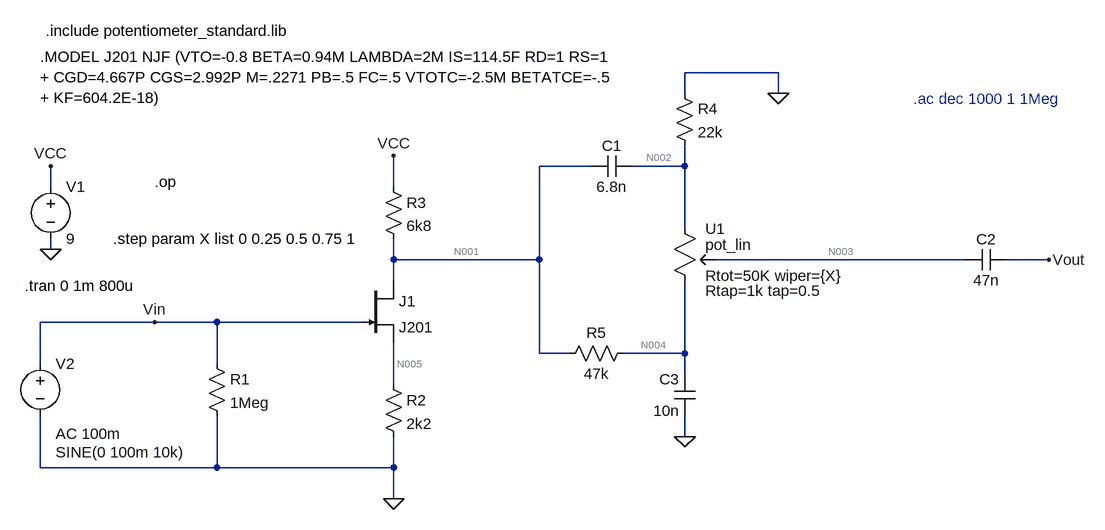
[diagram p0: schematic PrimerEtapa.asc]
PrimerEtapa.asc, the LTspice schematic file:
Version 4
SHEET 1 1232 776
WIRE 736 80 592 80
WIRE 592 112 592 80
WIRE 736 112 736 80
WIRE 448 224 368 224
WIRE 592 224 592 192
WIRE 592 224 512 224
WIRE -384 256 -384 224
WIRE 144 256 144 208
WIRE 592 320 592 224
WIRE -384 352 -384 336
WIRE 144 368 144 336
WIRE 368 368 368 224
WIRE 368 368 144 368
WIRE 1024 368 640 368
WIRE 1152 368 1088 368
WIRE 144 400 144 368
WIRE -224 464 -400 464
WIRE -128 464 -224 464
WIRE 96 464 -128 464
WIRE 368 512 368 368
WIRE 416 512 368 512
WIRE 592 512 592 400
WIRE 592 512 496 512
WIRE -400 528 -400 464
WIRE -128 528 -128 464
WIRE 592 544 592 512
WIRE 144 560 144 496
WIRE 592 640 592 608
WIRE -400 688 -400 608
WIRE -128 688 -128 608
WIRE -128 688 -400 688
WIRE 144 688 144 640
WIRE 144 688 -128 688
WIRE 144 736 144 688
FLAG 144 736 0
FLAG -384 352 0
FLAG -384 224 VCC
FLAG 144 208 VCC
FLAG -224 464 Vin
FLAG 592 640 0
FLAG 1152 368 Vout
FLAG 736 112 0
SYMBOL njf 96 400 R0
SYMATTR InstName J1
SYMATTR Value J201
SYMBOL res -144 512 R0
SYMATTR InstName R1
SYMATTR Value 1Meg
SYMBOL res 128 544 R0
SYMATTR InstName R2
SYMATTR Value 2k2
SYMBOL res 128 240 R0
SYMATTR InstName R3
SYMATTR Value 6k8
SYMBOL voltage -384 240 R0
SYMATTR InstName V1
SYMATTR Value 9
SYMBOL voltage -400 512 R0
WINDOW 3 24 152 Left 2
WINDOW 123 24 124 Left 2
WINDOW 39 0 0 Left 2
SYMATTR Value SINE(0 100m 10k)
SYMATTR Value2 AC 100m
SYMATTR InstName V2
SYMBOL cap 512 208 R90
WINDOW 0 0 32 VBottom 2
WINDOW 3 32 32 VTop 2
SYMATTR InstName C1
SYMATTR Value 6.8n
SYMBOL cap 1088 352 R90
WINDOW 0 0 32 VBottom 2
WINDOW 3 32 32 VTop 2
SYMATTR InstName C2
SYMATTR Value 47n
SYMBOL cap 608 608 R180
WINDOW 0 24 56 Left 2
WINDOW 3 24 8 Left 2
SYMATTR InstName C3
SYMATTR Value 10n
SYMBOL res 576 96 R0
SYMATTR InstName R4
SYMATTR Value 22k
SYMBOL res 512 496 R90
WINDOW 0 0 56 VBottom 2
WINDOW 3 32 56 VTop 2
SYMATTR InstName R5
SYMATTR Value 47k
SYMBOL potentiometer_standard 576 304 R0
SYMATTR InstName U1
SYMATTR Value Rtot=50K wiper={X}
TEXT -400 56 Left 2 !.MODEL J201 NJF (VTO=-0.8 BETA=0.94M LAMBDA=2M IS=114.5F RD=1 RS=1\n+ CGD=4.667P CGS=2.992P M=.2271 PB=.5 FC=.5 VTOTC=-2.5M BETATCE=-.5\n+ KF=604.2E-18)
TEXT -424 408 Left 2 !.tran 0 1m 800u
TEXT -224 248 Left 2 !.op
TEXT -392 16 Left 2 !.include potentiometer_standard.lib
TEXT -288 336 Left 2 !.step param X list 0 0.25 0.5 0.75 1
TEXT 944 120 Left 2 ;.ac dec 1000 1 1Meg

The netlist it stands for:
* PrimerEtapa.asc
J1 N001 Vin N005 J201
R1 Vin 0 1Meg
R2 N005 0 2k2
R3 VCC N001 6k8
V1 VCC 0 9
V2 Vin 0 SINE(0 100m 10k) AC 100m
C1 N002 N001 6.8n
C2 Vout N003 47n
C3 0 N004 10n
R4 0 N002 22k
R5 N004 N001 47k
XU1 N002 N004 N003 pot_lin Rtot=50K wiper={X} Rtap=1k tap=0.5  ; pins A B C
.model NJF NJF
.model PJF PJF
.lib standard.jft
.MODEL J201 NJF (VTO=-0.8 BETA=0.94M LAMBDA=2M IS=114.5F RD=1 RS=1
+ CGD=4.667P CGS=2.992P M=.2271 PB=.5 FC=.5 VTOTC=-2.5M BETATCE=-.5
+ KF=604.2E-18)
.tran 0 1m 800u
.op
.include potentiometer_standard.lib
.step param X list 0 0.25 0.5 0.75 1
* .ac dec 1000 1 1Meg
.backanno
.end

* Results of the author's LTspice run, read from the files saved beside the schematic
* Operating Point (first step), zero values left out:
*   V(n001) = 7.413 V
*   V(n005) = 376.3 mV
*   V(vcc) = 9 V
*   V(n002) = 1.371 V
*   V(vout) = 210.8 nV
*   V(n003) = 4.485 V
*   V(n004) = 4.485 V
*   Id(J1) = 171 µA
*   Ig(J1) = -8.019 pA
*   Is(J1) = -171 µA
*   I(R5) = -62.3 µA
*   I(R4) = -62.3 µA
*   I(R3) = 233.3 µA
*   I(R2) = 171 µA
*   I(V2) = 8.019 pA
*   I(V1) = -233.3 µA
*   Ix(u1:1) = -62.3 µA
*   Ix(u1:2) = 62.3 µA
* From the log:
*   Semiconductor Device Operating Points:
*                           --- JFET Transistors ---
*   Name:      j1
*   Model:    j201
*   Id:      1.71e-04
*   Vgs:    -3.76e-01
*   Vds:     7.04e+00
*   Gm:      8.08e-04
*   Gds:     3.37e-07
*   Cgs:     2.63e-12
*   Cgd:     2.49e-12